# EAGLE design proto2board (EAGLE 9.6.2)
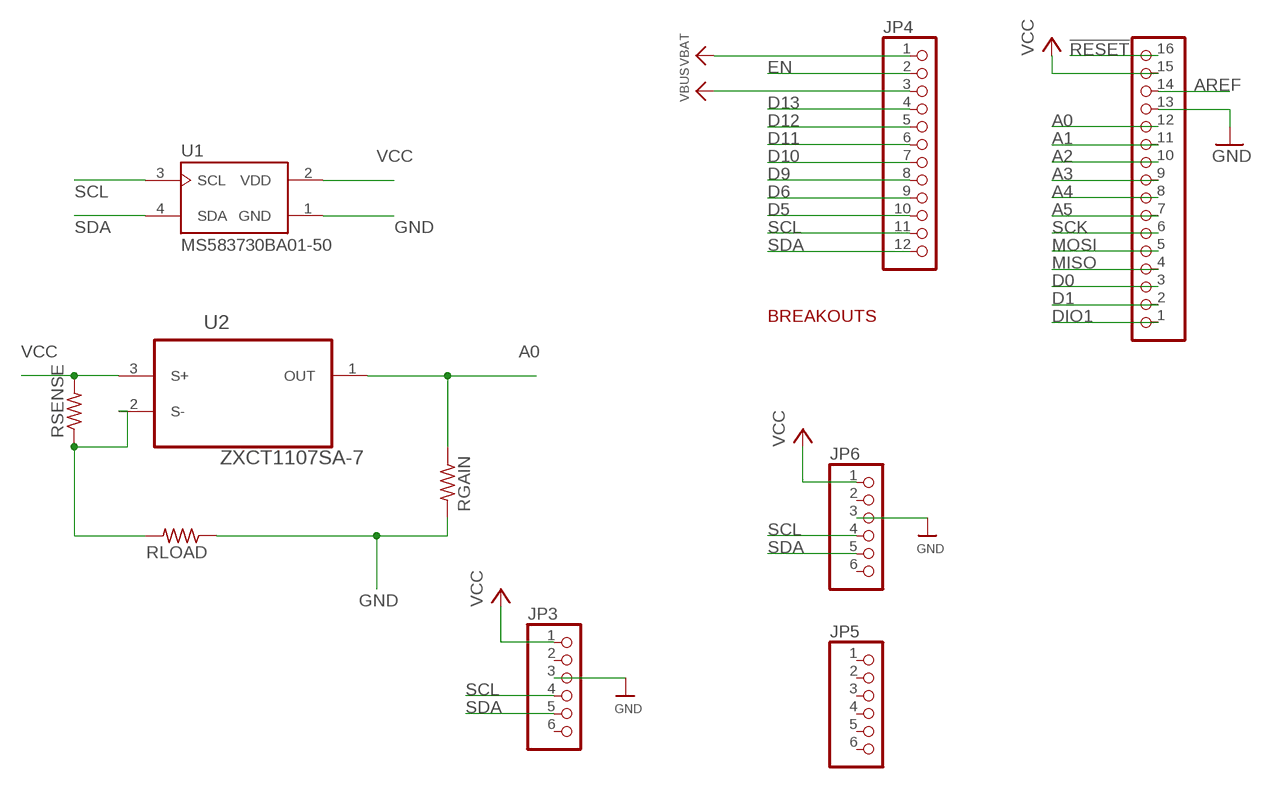
[diagram p0: schematic, sheet 1]

## Parts
JP2  HEADER-1X16ROUND  [1X16_ROUND]
JP3  HEADER-1X670MIL  [1X06_ROUND_70]
JP4  HEADER-1X12  [1X12_ROUND]
JP5  HEADER-1X6ROUND  [1X06_ROUND]
JP6  HEADER-1X670MIL  [1X06_ROUND_70]
RGAIN  R-US_0204/7  [0204/7]
RLOAD  R-US_0204/7  [0204/7]
RSENSE  R-US_0204/7  [0204/7]
U1  MS583730BA01-50  [TE_MS583730BA01-50]
U2  ZXCT1107SA-7  [SOT91P240X110-3N]

## Nets
!RESET: JP2.16
A0: JP2.12 RGAIN.1 U2.1(OUT)
A1: JP2.11
A2: JP2.10
A3: JP2.9
A4: JP2.8
A5: JP2.7
AREF: JP2.14
D0: JP2.3
D1: JP2.2
D5: JP4.10
D6: JP4.9
D9: JP4.8
D10: JP4.7
D11: JP4.6
D12: JP4.5
D13: JP4.4
DIO1: JP2.1
EN: JP4.2
GND [highpower]: JP2.13 JP3.3 JP6.3 RGAIN.2 RLOAD.1 U1.1(GND)
MISO: JP2.4
MOSI: JP2.5
N$2: RLOAD.2 RSENSE.1 U2.2(S-)
SCK: JP2.6
SCL: JP3.4 JP4.11 JP6.4 U1.3(SCL)
SDA: JP3.5 JP4.12 JP6.5 U1.4(SDA)
VBAT: JP4.1
VBUS: JP4.3
VCC [highpower]: JP2.15 JP3.1 JP6.1 RSENSE.2 U1.2(VDD) U2.3(S+)
Unconnected: JP3.2 JP3.6 JP5.1 JP5.2 JP5.3 JP5.4 JP5.5 JP5.6 JP6.2 JP6.6

## Notes on the sheet
- BREAKOUTS

## Library data of the parts
JP2 = microbuilder:HEADER-1X16: PIN HEADER
JP3 JP5 JP6 = microbuilder:HEADER-1X6: PIN HEADER
JP4 = microbuilder:HEADER-1X12
RGAIN RLOAD RSENSE = rcl:R-US_: RESISTOR, American symbol; SPICEPREFIX: R
U1 = MS583730BA01-50:MS583730BA01-50: SENSOR PRESSURE UNDERWATER; COMMENT: MS583730BA01-50; DESCRIPTION: Waterproof Digital Pressure Ms583730ba01-50; DIGI-KEY_PART_NUMBER: 223-1704-1-ND; MF: TE Connectivity; MP: MS583730BA01-50; PACKAGE: SMD-4 TE Connectivity ALCOSWITCH Switches; PURCHASE-URL: https://pricing.snapeda.com/search/part/MS583730BA01-50/?ref=eda
U2 = ZXCT1107SA-7:ZXCT1107SA-7: LOW POWER HIGH-SIDE CURRENT MONITORS Check availability <https://pricing.snapeda.com/parts/ZXCT1107SA-7/Diodes%20Inc./view-part?ref=eda>; AVAILABILITY: In Stock; DESCRIPTION: Current Monitor Regulator High-Side - SOT-23-3; MF: Diodes Inc.; MP: ZXCT1107SA-7; PACKAGE: SOT-23-3 Diodes Inc.; PRICE: None; PURCHASE-URL: https://pricing.snapeda.com/search/part/ZXCT1107SA-7/?ref=eda

## Net classes
1 highpower: width 0.406 mm, drill 0.483 mm
2 lowpower: width 0.305 mm, drill 0.483 mm

## Board
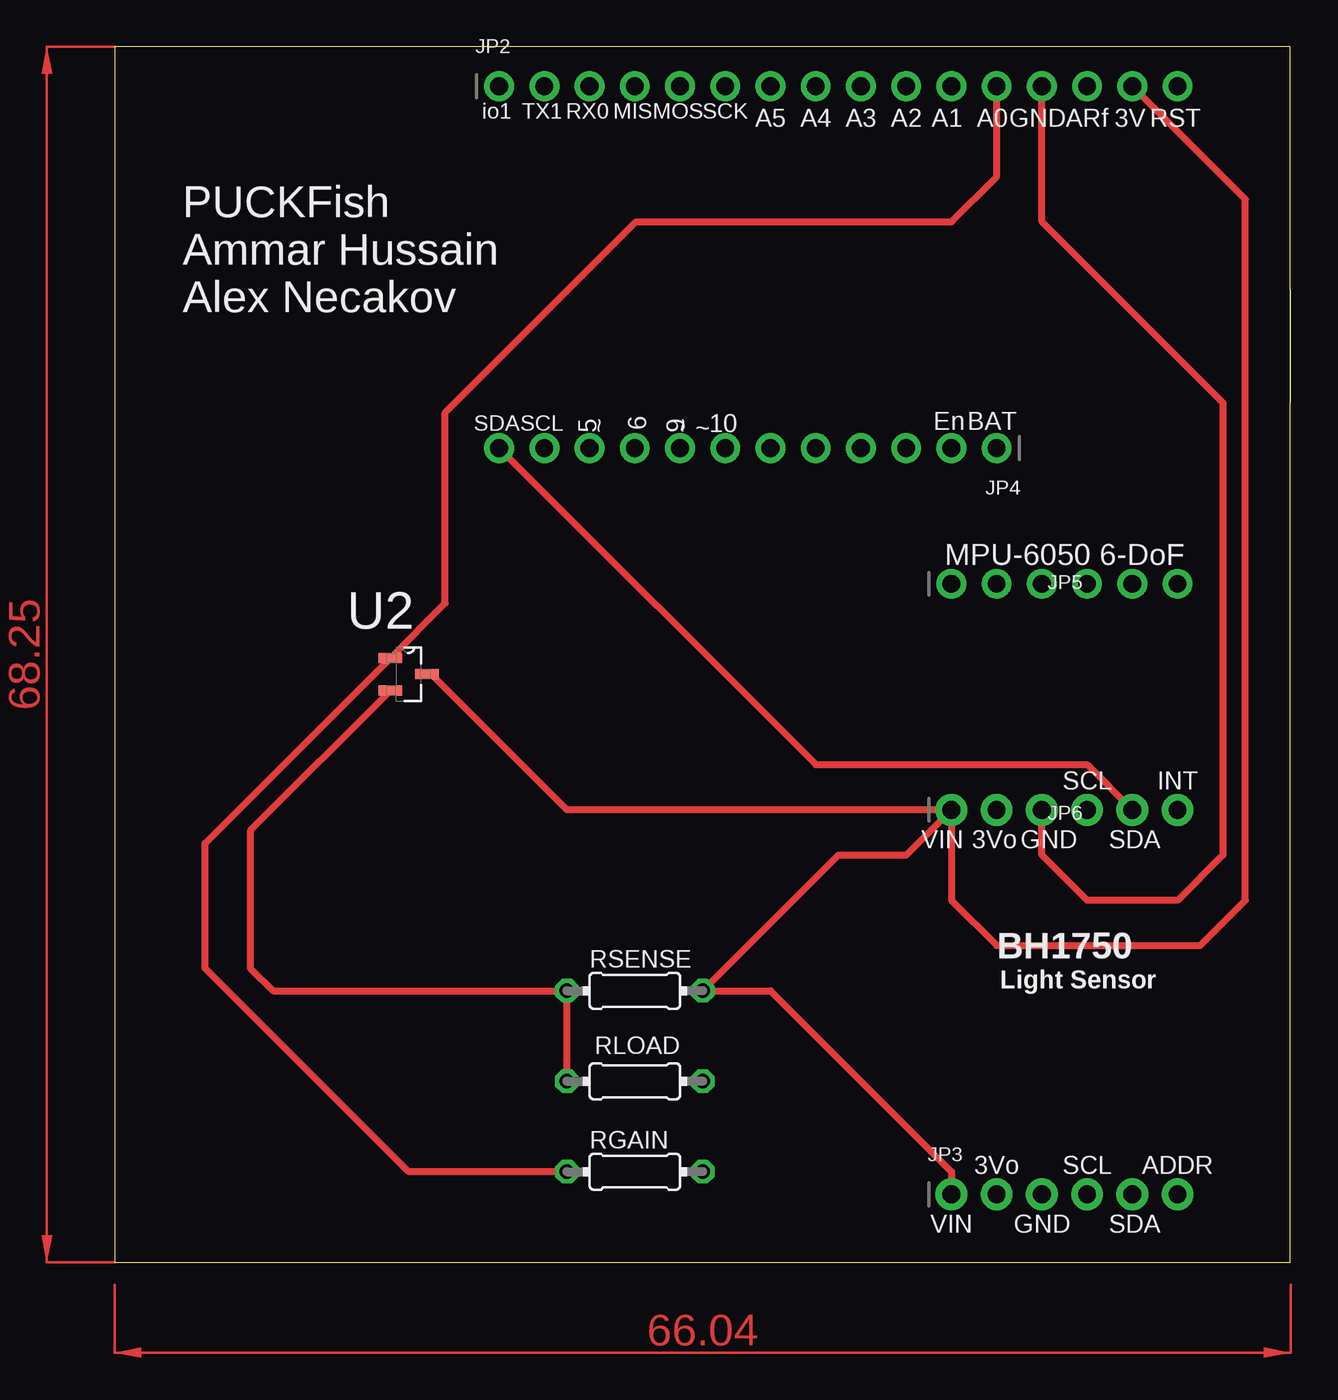
[diagram p1: board, top side]
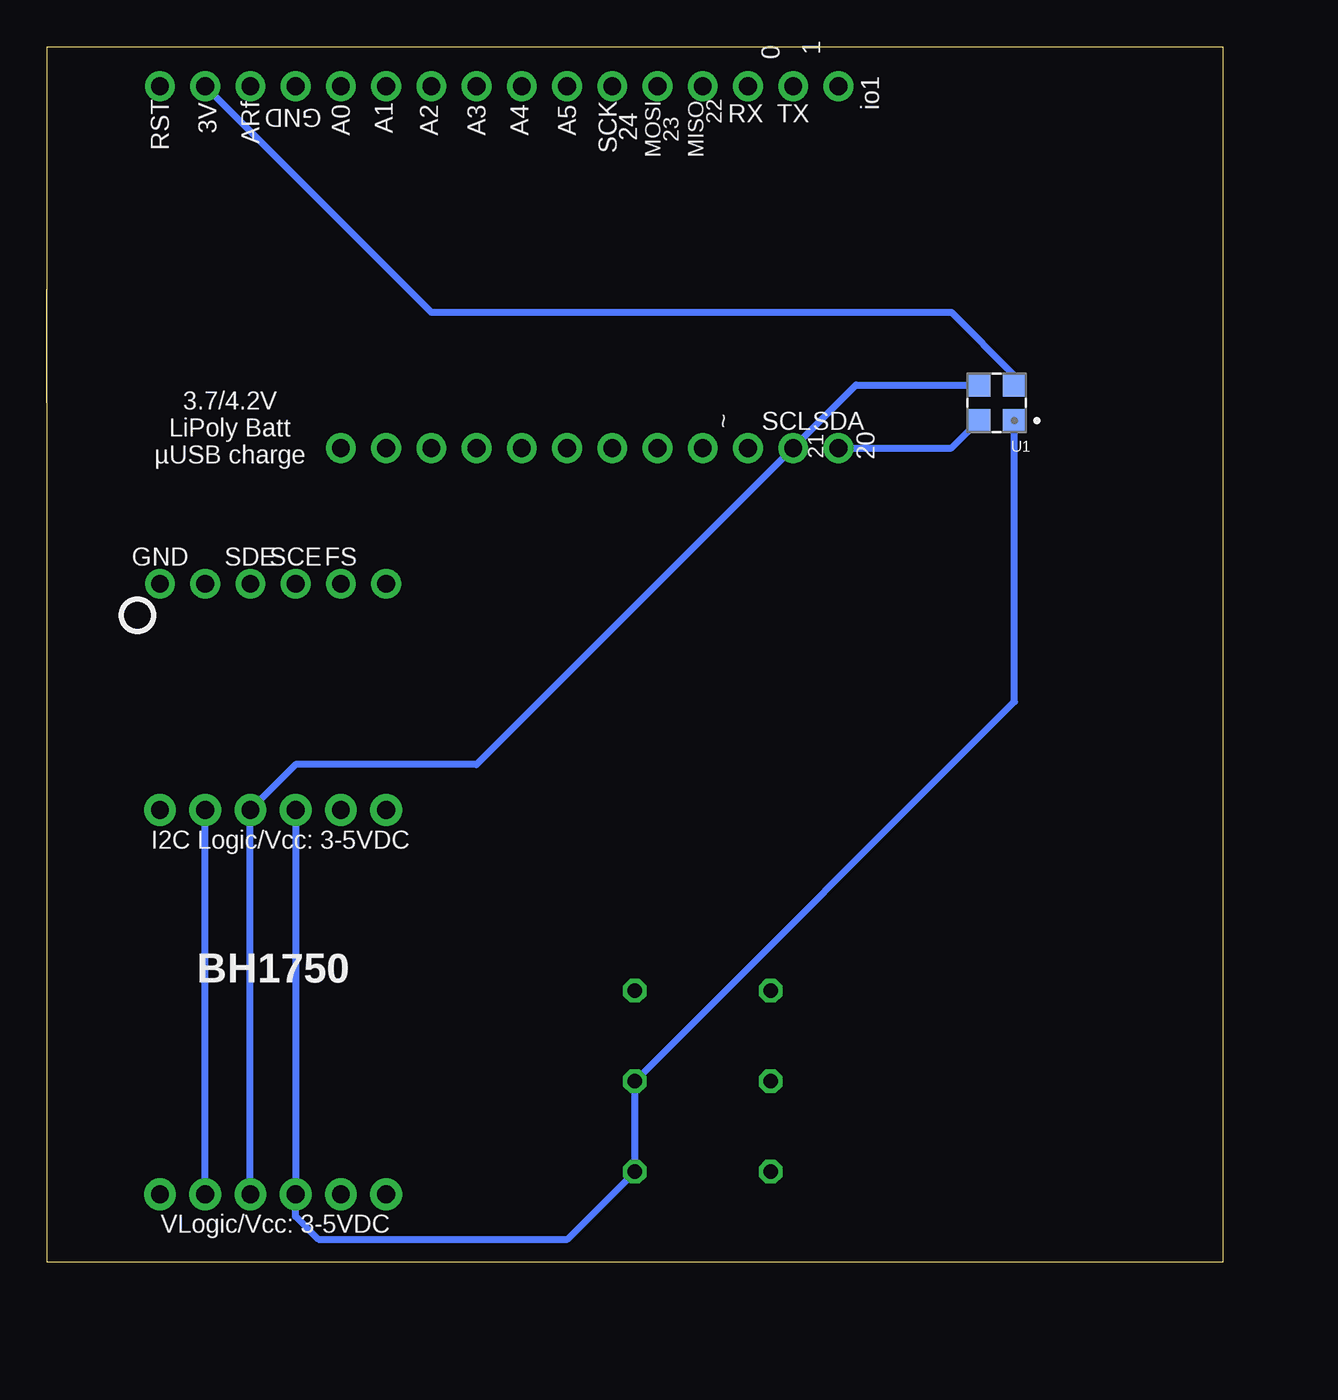
[diagram p2: board, bottom side, seen from below]

Size 66.04 x 68.25 mm. Coordinates in mm from the lower left corner, seen from the top.
Outline: 66.04,48.26 66.04,54.61
Outline: 0,0 66.02,0 66.02,68.25 0,68.25 0,0
Copper layers (1*16): Top 0.035mm / dielectric 1.5mm / Bottom 0.035mm
Design rules "default": minimum track width 6mil, minimum drill 0.35mm, track to track 6mil, track to pad 6mil, pad to pad 6mil, via to via 6mil, smd to smd 6mil, copper to edge 40mil, drill to drill 6mil, minimum pad ring 10mil, minimum via ring 8mil, stop-mask expansion 4mil, vias tented up to drill 0mil, thermal gap 10mil

### Footprints (pad centres in the part's own frame; a part is rotated, then mirrored left to right if it is on the bottom)
1X16_ROUND = drill 1 pad 1.676: 1 -19.05,0; 2 -16.51,0; 3 -13.97,0; 4 -11.43,0; 5 -8.89,0; 6 -6.35,0; 7 -3.81,0; 8 -1.27,0; 9 1.27,0; 10 3.81,0; 11 6.35,0; 12 8.89,0; 13 11.43,0; 14 13.97,0; 15 16.51,0; 16 19.05,0
1X06_ROUND_70 = drill 1 pad 1.778: 1 -6.35,0; 2 -3.81,0; 3 -1.27,0; 4 1.27,0; 5 3.81,0; 6 6.35,0
1X12_ROUND = drill 1 pad 1.676: 1 -13.97,0; 2 -11.43,0; 3 -8.89,0; 4 -6.35,0; 5 -3.81,0; 6 -1.27,0; 7 1.27,0; 8 3.81,0; 9 6.35,0; 10 8.89,0; 11 11.43,0; 12 13.97,0
1X06_ROUND = drill 1 pad 1.676: 1 -6.35,0; 2 -3.81,0; 3 -1.27,0; 4 1.27,0; 5 3.81,0; 6 6.35,0
0204/7 = drill 0.813 octagon: 1 -3.81,0; 2 3.81,0
TE_MS583730BA01-50 = smd 1.3 x 1.3: 1 -1,1; 2 -1,-1; 3 1,-1; 4 1,1
SOT91P240X110-3N = smd 1.321 x 0.559: 1 -1.016,0.914; 2 -1.016,-0.914; 3 1.016,0

### Placement (x,y rotation side)
JP2  40.64,66.04 0 top
JP3  53.34,3.81 0 top
JP4  35.56,45.72 180 top
JP5  53.34,38.1 0 top
JP6  53.34,25.4 0 top
RGAIN  29.21,5.08 0 top
RLOAD  29.21,10.16 180 top
RSENSE  29.21,15.24 0 top
U1  12.7,48.26 180 bottom
U2  16.51,33.02 0 top
U$6  [PCBFEAT-REV-040]  60.96,36.32 0 bottom

### Tracks (layer width: path | path; a pad name or v marks a point on that pad's centre or on a via)
A0
  Top 0.406: JP2.12 49.53,60.96 46.99,58.42 29.27,58.42 18.57,47.72 18.57,37.01 U2.1 5.08,23.52 5.08,16.51 16.51,5.08 RGAIN.1
GND
  Top 0.406: JP2.13 52.07,58.42 62.23,48.26 62.23,22.86 59.69,20.32 54.61,20.32 52.07,22.86 JP6.3
  Bottom 0.406: JP6.3 JP3.3 | JP3.3 52.07,3.32 | U1.1 11.7,31.48 RLOAD.1 RGAIN.2 36.8,1.3 50.8,1.3 52.07,2.56 JP3.3
N$2
  Top 0.406: U2.2 7.62,24.23 7.62,16.51 8.89,15.24 RSENSE.1 RLOAD.2
SCL
  Bottom 0.406: JP3.4 JP6.4 52.07,27.94 41.91,27.94 JP4.11 20.59,49.26 U1.3
SDA
  Top 0.406: JP4.12 39.37,27.94 54.61,27.94 JP6.5
  Bottom 0.406: JP3.5 JP6.5 | JP4.12 15.24,45.72 U1.4
VCC
  Top 0.406: JP3.1 46.99,5.08 36.83,15.24 RSENSE.2 40.64,22.86 44.45,22.86 JP6.1 | JP6.1 25.4,25.4 17.78,33.02 U2.3 | JP6.1 46.99,20.32 49.53,17.78 60.96,17.78 63.5,20.32 63.5,59.69 JP2.15
  Bottom 0.406: JP2.15 44.45,53.34 15.24,53.34 11.7,49.8 U1.2
(copper drawn outside any net)
  shapes: Top area x2

### Text on the board
tPlace: io1 | TX1 | RX0 | MIS | MOS | SCK | A5 | A4 | A3 | A2 | A1 | A0 | GND | ARf | 3V | RST | SDA | SCL | 5 | ~ | 6 | 9 | ~ | ~ | 10 | En | BAT | MPU-6050 6-DoF | SCL | INT | VIN | 3Vo | GND | SDA | BH1750 | Light Sensor | 3Vo | SCL | ADDR | VIN | GND | SDA
bPlace: 1 | 0 | io1 | TX | RX | 22 | 24 | SCK | A5 | A4 | A3 | A2 | A1 | A0 | GND | ARf | 3V | RST | MISO | 23 | MOSI | SDA | SCL | ~ | 3.7/4.2V / LiPoly Batt / µUSB charge | 20 | 21 | FS | SCE | SDE | GND | I2C Logic/Vcc: 3-5VDC | BH1750 | VLogic/Vcc: 3-5VDC
tNames: PUCKFish / Ammar Hussain / Alex Necakov